# Altium project retic.PrjPCB
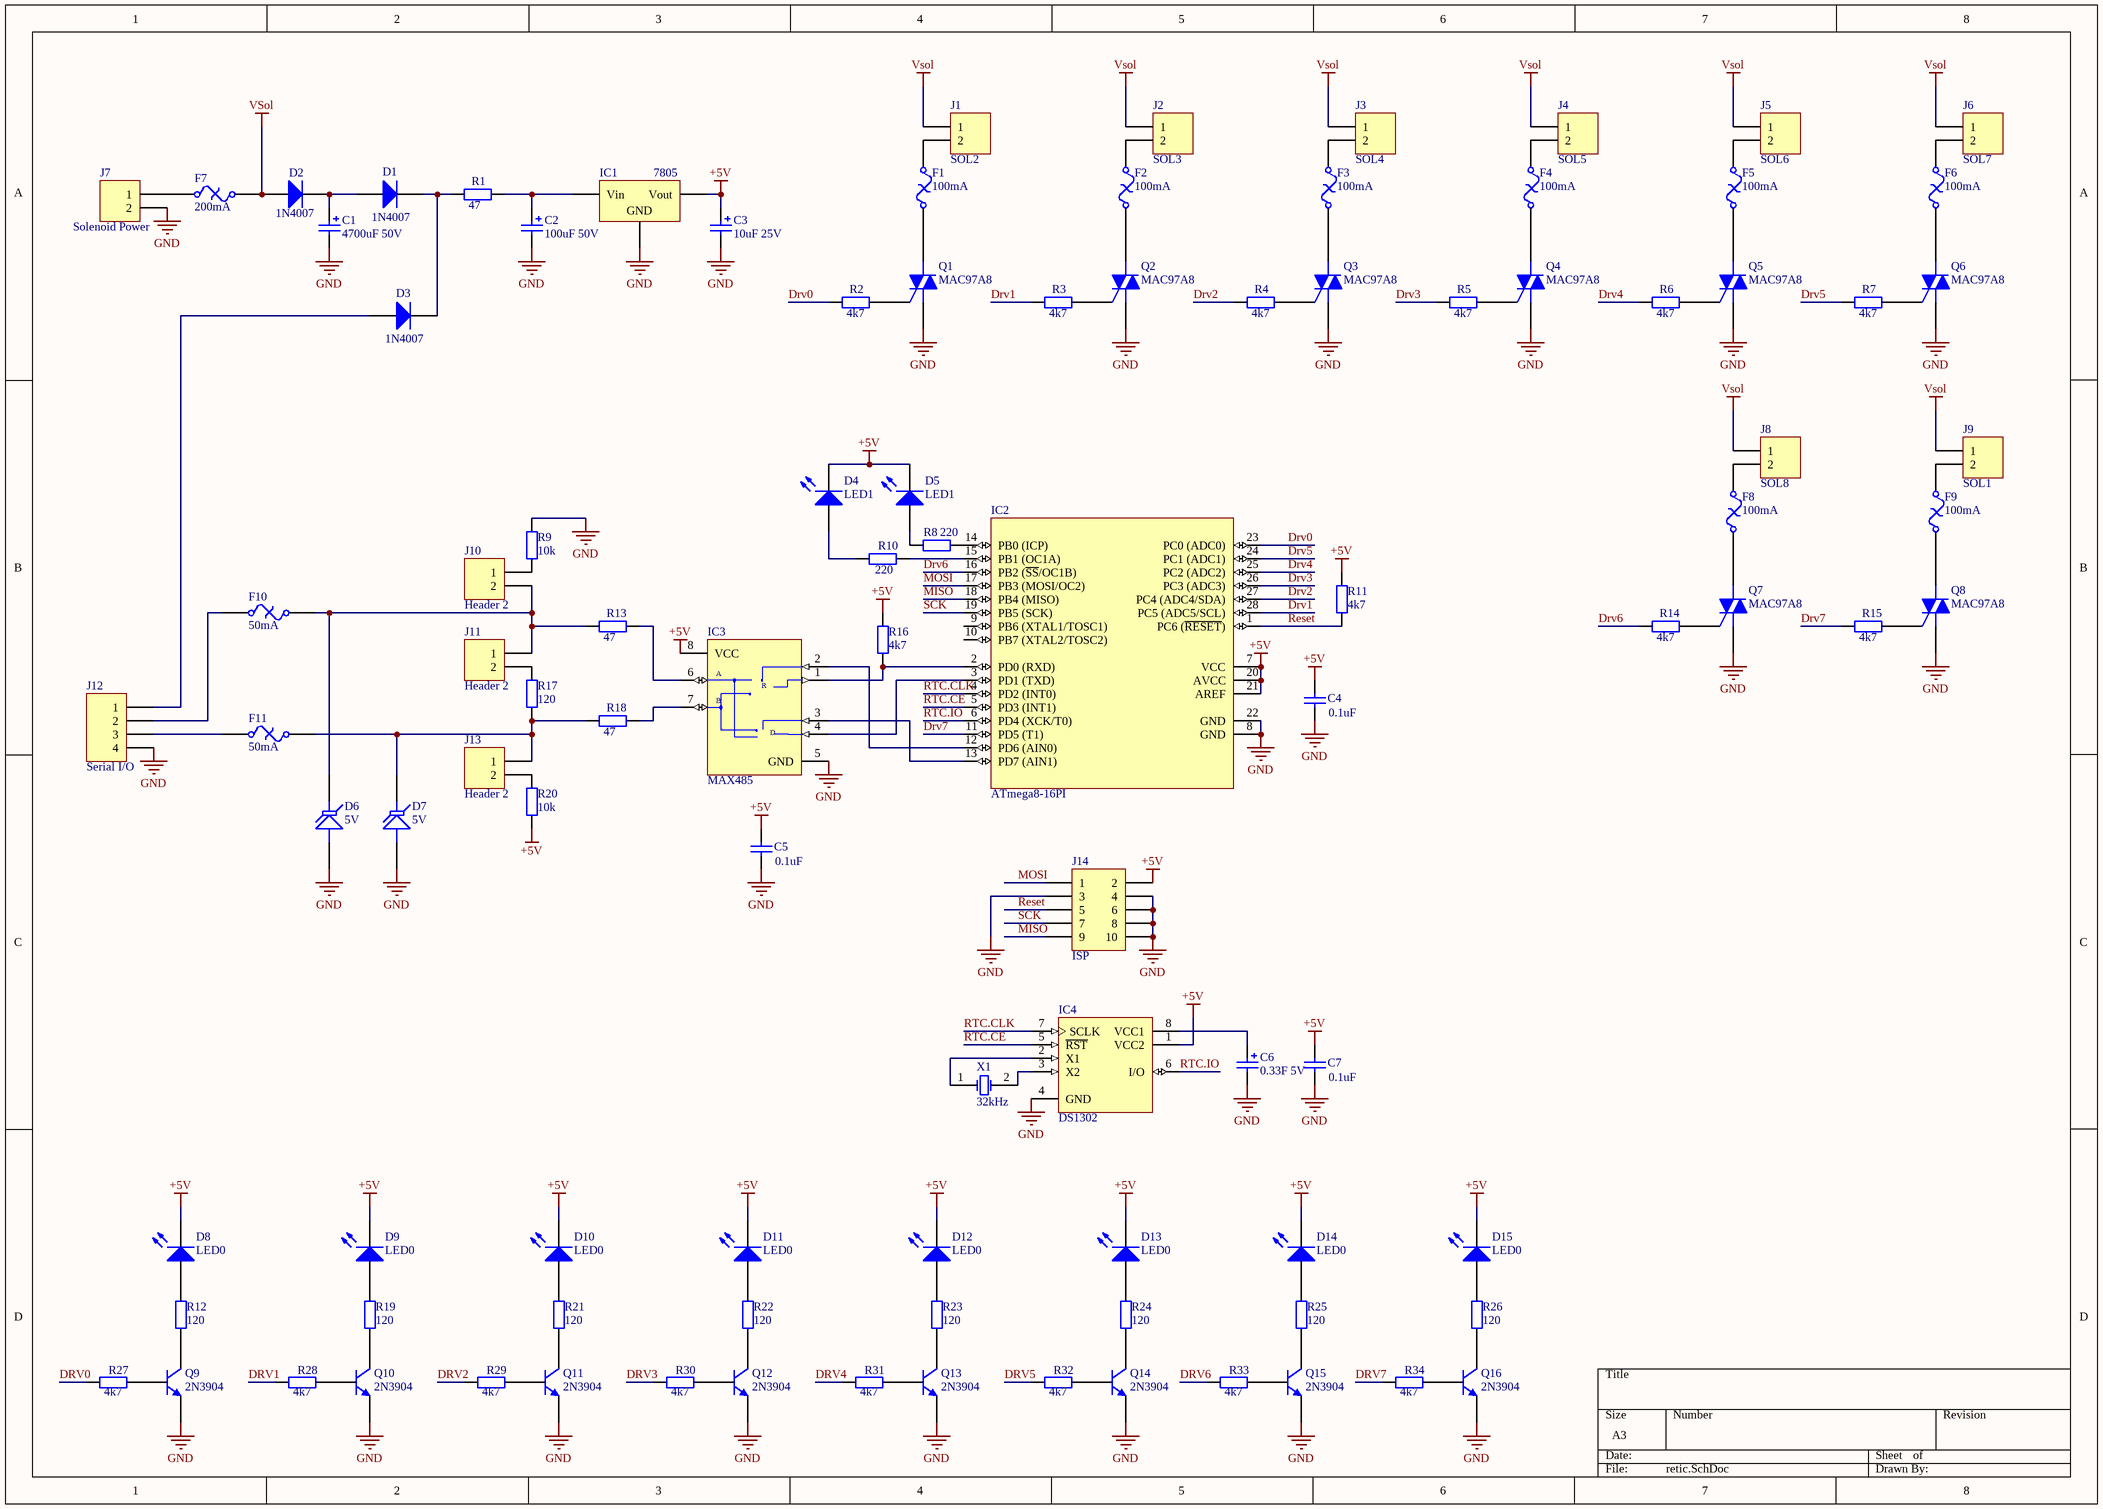
[diagram p0: retic.SchDoc]
1 sheet, 102 parts. Net scope: global (net labels, ports and power ports of the same name join across sheets).
Board file: retic.PcbDoc

## Sheet retic.SchDoc
size A3

### Parts
C1  4700uF 50V  [CAPPR7.5-16x35]
C2  100uF 50V  [CAPPR5-5x5]
C3  10uF 25V  [CAPPR2-5x6.8]
C4  0.1uF  [RAD-0.3]
C5  0.1uF  [RAD-0.3]
C6  0.33F 5V  [POLAR0.8]
C7  0.1uF  [RAD-0.3]
D1  1N4007  [DIO10.46-5.3x2.8]
D2  1N4007  [DIO10.46-5.3x2.8]
D3  1N4007  [DIO10.46-5.3x2.8]
D4  LED1  [LED-1]
D5  LED1  [LED-1]
D6  5V  [DIO10.2-7x2.7]
D7  5V  [DIO10.2-7x2.7]
D8  LED0  [LED-0]
D9  LED0  [LED-0]
D10  LED0  [LED-0]
D11  LED0  [LED-0]
D12  LED0  [LED-0]
D13  LED0  [LED-0]
D14  LED0  [LED-0]
D15  LED0  [LED-0]
F1  100mA  [PIN-W2/E2.8]
F2  100mA  [PIN-W2/E2.8]
F3  100mA  [PIN-W2/E2.8]
F4  100mA  [PIN-W2/E2.8]
F5  100mA  [PIN-W2/E2.8]
F6  100mA  [PIN-W2/E2.8]
F7  200mA  [PIN-W2/E2.8]
F8  100mA  [PIN-W2/E2.8]
F9  100mA  [PIN-W2/E2.8]
F10  50mA  [PIN-W2/E2.8]
F11  50mA  [PIN-W2/E2.8]
IC1  7805  [TO220]
IC2  ATmega8-16PI  [28P3]
IC3  MAX485  [PA8]
IC4  DS1302  [DIP8]
J1  SOL2  [Screw2]
J2  SOL3  [Screw2]
J3  SOL4  [Screw2]
J4  SOL5  [Screw2]
J5  SOL6  [Screw2]
J6  SOL7  [Screw2]
J7  Solenoid Power  [HDR1X2]
J8  SOL8  [Screw2]
J9  SOL1  [Screw2]
J10  Header 2  [HDR1X2]
J11  Header 2  [HDR1X2]
J12  Serial I/O  [HDR1X4]
J13  Header 2  [HDR1X2]
J14  ISP  [HDR2X5]
Q1  MAC97A8  [T092]
Q2  MAC97A8  [T092]
Q3  MAC97A8  [T092]
Q4  MAC97A8  [T092]
Q5  MAC97A8  [T092]
Q6  MAC97A8  [T092]
Q7  MAC97A8  [T092]
Q8  MAC97A8  [T092]
Q9  2N3904  [T092]
Q10  2N3904  [T092]
Q11  2N3904  [T092]
Q12  2N3904  [T092]
Q13  2N3904  [T092]
Q14  2N3904  [T092]
Q15  2N3904  [T092]
Q16  2N3904  [T092]
R1  47  [AXIAL-0.3]
R2  4k7  [AXIAL-0.3]
R3  4k7  [AXIAL-0.3]
R4  4k7  [AXIAL-0.3]
R5  4k7  [AXIAL-0.3]
R6  4k7  [AXIAL-0.3]
R7  4k7  [AXIAL-0.3]
R8  220  [AXIAL-0.3]
R9  10k  [AXIAL-0.3]
R10  220  [AXIAL-0.3]
R11  4k7  [AXIAL-0.3]
R12  120  [AXIAL-0.3]
R13  47  [AXIAL-0.3]
R14  4k7  [AXIAL-0.3]
R15  4k7  [AXIAL-0.3]
R16  4k7  [AXIAL-0.3]
R17  120  [AXIAL-0.3]
R18  47  [AXIAL-0.3]
R19  120  [AXIAL-0.3]
R20  10k  [AXIAL-0.3]
R21  120  [AXIAL-0.3]
R22  120  [AXIAL-0.3]
R23  120  [AXIAL-0.3]
R24  120  [AXIAL-0.3]
R25  120  [AXIAL-0.3]
R26  120  [AXIAL-0.3]
R27  4k7  [AXIAL-0.3]
R28  4k7  [AXIAL-0.3]
R29  4k7  [AXIAL-0.3]
R30  4k7  [AXIAL-0.3]
R31  4k7  [AXIAL-0.3]
R32  4k7  [AXIAL-0.3]
R33  4k7  [AXIAL-0.3]
R34  4k7  [AXIAL-0.3]
X1  32kHz  [BCY-W2/D3.1]

### Nets
+5V: C3.1 C4.2 C5.2 C7.2 D4.2(K) D5.2(K) D8.2(K) D9.2(K) D10.2(K) D11.2(K) D12.2(K) D13.2(K) D14.2(K) D15.2(K) IC1.3(Vout) IC2.7(VCC) IC2.20(AVCC) IC2.21(AREF) IC3.8(VCC) IC4.1(VCC2) J14.2 R11.2 R16.2 R20.1
GND: C1.2 C2.2 C3.2 C4.1 C5.1 C6.2 C7.1 D6.1(A) D7.1(A) IC1.2(GND) IC2.8(GND) IC2.22(GND) IC3.5(GND) IC4.4(GND) J7.2 J12.4 J14.3 J14.4 J14.6 J14.8 J14.10 Q1.3(M1) Q2.3(M1) Q3.3(M1) Q4.3(M1) Q5.3(M1) Q6.3(M1) Q7.3(M1) Q8.3(M1) Q9.1(E) Q10.1(E) Q11.1(E) Q12.1(E) Q13.1(E) Q14.1(E) Q15.1(E) Q16.1(E) R9.2
Vsol: D2.1(A) F7.1 J1.1 J2.1 J3.1 J4.1 J5.1 J6.1 J8.1 J9.1
Drv0: IC2.23(PC0_(ADC0)) R2.1 R27.1
Drv1: IC2.28(PC5_(ADC5/SCL)) R3.1 R28.1
Drv2: IC2.27(PC4_(ADC4/SDA)) R4.1 R29.1
Drv3: IC2.26(PC3_(ADC3)) R5.1 R30.1
Drv4: IC2.25(PC2_(ADC2)) R6.1 R31.1
Drv5: IC2.24(PC1_(ADC1)) R7.1 R32.1
Drv6: IC2.16(PB2_(~{SS}/OC1B)) R14.1 R33.1
Drv7: IC2.11(PD5_(T1)) R15.1 R34.1
MISO: IC2.18(PB4_(MISO)) J14.9
MOSI: IC2.17(PB3_(MOSI/OC2)) J14.1
Reset: IC2.1(PC6_(~{RESET})) J14.5 R11.1
RTC.CE: IC2.5(PD3_(INT1)) IC4.5(~{RST})
RTC.CLK: IC2.4(PD2_(INT0)) IC4.7(SCLK)
RTC.IO: IC2.6(PD4_(XCK/T0)) IC4.6(I/O)
SCK: IC2.19(PB5_(SCK)) J14.7
NetC1_1: C1.1 D1.1(A) D2.2(K)
NetC2_1: C2.1 IC1.1(Vin) R1.2
NetC6_1: C6.1 IC4.8(VCC1)
NetD1_2: D1.2(K) D3.2(K) R1.1
NetD3_1: D3.1(A) J12.1
NetD4_1: D4.1(A) R10.2
NetD5_1: D5.1(A) R8.2
NetD6_2: D6.2(K) F10.1 J10.2 J11.1 R13.1
NetD7_2: D7.2(K) F11.1 J13.1 R17.1 R18.1
NetD8_1: D8.1(A) R12.2
NetD9_1: D9.1(A) R19.2
NetD10_1: D10.1(A) R21.2
NetD11_1: D11.1(A) R22.2
NetD12_1: D12.1(A) R23.2
NetD13_1: D13.1(A) R24.2
NetD14_1: D14.1(A) R25.2
NetD15_1: D15.1(A) R26.2
NetF1_1: F1.1 Q1.1(M2)
NetF1_2: F1.2 J1.2
NetF2_1: F2.1 Q2.1(M2)
NetF2_2: F2.2 J2.2
NetF3_1: F3.1 Q3.1(M2)
NetF3_2: F3.2 J3.2
NetF4_1: F4.1 Q4.1(M2)
NetF4_2: F4.2 J4.2
NetF5_1: F5.1 Q5.1(M2)
NetF5_2: F5.2 J5.2
NetF6_1: F6.1 Q6.1(M2)
NetF6_2: F6.2 J6.2
NetF7_2: F7.2 J7.1
NetF8_1: F8.1 Q7.1(M2)
NetF8_2: F8.2 J8.2
NetF9_1: F9.1 Q8.1(M2)
NetF9_2: F9.2 J9.2
NetF10_2: F10.2 J12.2
NetF11_2: F11.2 J12.3
NetIC2_2: IC2.2(PD0_(RXD)) IC3.1(RO) R16.1
NetIC2_3: IC2.3(PD1_(TXD)) IC3.4(DI)
NetIC2_12: IC2.12(PD6_(AIN0)) IC3.2(~{RE})
NetIC2_13: IC2.13(PD7_(AIN1)) IC3.3(DE)
NetIC2_14: IC2.14(PB0_(ICP)) R8.1
NetIC2_15: IC2.15(PB1_(OC1A)) R10.1
NetIC3_6: IC3.6(A) R13.2
NetIC3_7: IC3.7(B) R18.2
NetIC4_2: IC4.2(X1) X1.1(OSC1)
NetIC4_3: IC4.3(X2) X1.2(OSC2)
NetJ10_1: J10.1 R9.1
NetJ11_2: J11.2 R17.2
NetJ13_2: J13.2 R20.2
NetQ1_2: Q1.2(G) R2.2
NetQ2_2: Q2.2(G) R3.2
NetQ3_2: Q3.2(G) R4.2
NetQ4_2: Q4.2(G) R5.2
NetQ5_2: Q5.2(G) R6.2
NetQ6_2: Q6.2(G) R7.2
NetQ7_2: Q7.2(G) R14.2
NetQ8_2: Q8.2(G) R15.2
NetQ9_2: Q9.2(B) R27.2
NetQ9_3: Q9.3(C) R12.1
NetQ10_2: Q10.2(B) R28.2
NetQ10_3: Q10.3(C) R19.1
NetQ11_2: Q11.2(B) R29.2
NetQ11_3: Q11.3(C) R21.1
NetQ12_2: Q12.2(B) R30.2
NetQ12_3: Q12.3(C) R22.1
NetQ13_2: Q13.2(B) R31.2
NetQ13_3: Q13.3(C) R23.1
NetQ14_2: Q14.2(B) R32.2
NetQ14_3: Q14.3(C) R24.1
NetQ15_2: Q15.2(B) R33.2
NetQ15_3: Q15.3(C) R25.1
NetQ16_2: Q16.2(B) R34.2
NetQ16_3: Q16.3(C) R26.1

Not connected (* = marked no-connect by the designer): IC2 9(PB6_(XTAL1/TOSC1)) 10(PB7_(XTAL2/TOSC2))

### Notes on the sheet
- (in symbol MAX485EPA) R; D

### Library data of the parts
C1-C3 C6 = Cap Pol2: Polarized Capacitor (Axial); Published: 8-Jun-2000; LatestRevisionDate: 17-Jul-2002; LatestRevisionNote: Re-released for DXP Platform.; PackageReference: POLAR0.8; Publisher: Altium Limited
  C1: Value: 4700uF 50V
  C2: Value: 100uF 50V
  C3: Value: 10uF 25V
  C6: Value: 0.33F 5V
C4 C5 C7 = Cap: Capacitor; Published: 8-Jun-2000; LatestRevisionDate: 17-Jul-2002; LatestRevisionNote: Re-released for DXP Platform.; PackageReference: RAD-0.3; Publisher: Altium Limited; Value: 0.1uF
D1-D3 = Diode 1N4007: 1 Amp General Purpose Rectifier; Published: 8-Jun-2000; LatestRevisionDate: 17-Jul-2002; LatestRevisionNote: Re-released for DXP Platform.; DatasheetVersion: 1998; PackageVersion: Aug-1999; PackageReference: DO-41; Publisher: Altium Limited; Code_JEDEC: DO-204-AL; ComponentLink1Description: Manufacturer Link; ComponentLink1URL: http://www.fairchildsemi.com/; ComponentLink2Description: Datasheet; ComponentLink2URL: http://www.fairchildsemi.com/ds/1N%2F1N4001.pdf
D4 D5 = LED1: Typical RED GaAs LED; Published: 8-Jun-2000; LatestRevisionDate: 08-Jul-2005; LatestRevisionNote: Mech Layer 1 removed.; PackageReference: LED-1; Publisher: Altium Limited
D6 D7 = Tranzorb: Published: 24-Mar-1999; LatestRevisionDate: 17-Jul-2002; LatestRevisionNote: Re-released for DXP Platform.; PackageReference: DO-7; Publisher: Altium Limited
D8-D15 = LED0: Typical INFRARED GaAs LED; Published: 8-Jun-2000; LatestRevisionDate: 08-Jul-2005; LatestRevisionNote: Mech Layer 1 removed.; PackageReference: LED-0; Publisher: Altium Limited
F1-F11 = Fuse Thermal: Thermal Fuse; Published: 24-Mar-1999; LatestRevisionDate: 17-Jul-2002; LatestRevisionNote: Re-released for DXP Platform.; PackageReference: PIN-W2/E2.8; Publisher: Altium Limited
IC1 = Volt Reg: Voltage Regulator; Published: 24-Mar-1999; LatestRevisionDate: 29-May-2009; LatestRevisionNote: IPC-7351 Footprint Added.; PackageReference: D2PAK; Publisher: Altium Limited; PackageDescription: 3-Pin Transistor Outline Package 2.54 mm Pitch, 15.1 mm Lead Span
IC2 = ATmega8-16PI: 8-Bit AVR Microcontroller with 8K Bytes of In-System Programmable Flash Memory; Published: 17-Sep-2003; LatestRevisionDate: 04-Mar-2005; LatestRevisionNote: Stylized 3D Model Added.; DatasheetVersion: 2486H-AVR-09/02; PackageVersion: revB, Sep-2001; PackageReference: 28P3; Publisher: Altium Limited; PackageDescription: DIP; 28 Leads; Row Spacing 7.62 mm; Pitch 2.54 mm; ComponentLink1Description: Manufacturer Link; ComponentLink1URL: http://www.atmel.com; ComponentLink2Description: Datasheet; ComponentLink2URL: http://www.atmel.com/dyn/resources/prod_documents/doc2486.pdf
IC3 = MAX485EPA: Low-Power, Slew-Rate-Limited RS-485/RS-422 Transceiver; Published: 16-Jan-2001; LatestRevisionDate: 29-May-2009; LatestRevisionNote: Component Body Added.; DatasheetVersion: Feb-1996; PackageVersion: RevB, 21-0043; PackageReference: PA8; Publisher: Altium Limited; PackageDescription: DIP, 8-Pin, Row Spacing 7.62 mm, Pitch 2.54 mm; Code_JEDEC: MS-001-AB; ComponentLink1Description: Manufacturer Link; ComponentLink1URL: http://www.maxim-ic.com/; ComponentLink2Description: Datasheet; ComponentLink2URL: http://pdfserv.maxim-ic.com/en/ds/MAX1487-MAX491.pdf
IC4 = DS1302: Trickle Charge Timekeeping Chip; Published: 13-Oct-2000; LatestRevisionDate: 06-Jun-2005; LatestRevisionNote: Stylized 3D Model Added.; DatasheetVersion: 2-Jul-1999; PackageVersion: 1999; PackageReference: DIP8; Publisher: Altium Limited; PackageDescription: DIP; 8 Leads; Row Spacing 7.62 mm; Pitch 2.54 mm; ComponentLink1Description: Manufacturer Link; ComponentLink1URL: http://www.maxim-ic.com/; ComponentLink2Description: Datasheet; ComponentLink2URL: http://pdfserv.maxim-ic.com/en/ds/DS1302.pdf
J1-J11 J13 = Header 2: Header, 2-Pin; LatestRevisionDate: 17-Jul-2002; LatestRevisionNote: Re-released for DXP Platform.; Publisher: Altium Limited
J12 = Header 4: Header, 4-Pin; LatestRevisionDate: 17-Jul-2002; LatestRevisionNote: Re-released for DXP Platform.; Publisher: Altium Limited
J14 = Header 5X2: Header, 5-Pin, Dual row; LatestRevisionDate: 17-Jul-2002; LatestRevisionNote: Re-released for DXP Platform.; Publisher: Altium Limited
Q1-Q8 = Triac: Silicon Bidirectional Triode Thyristor; Note: Pin 2 is electrically connected to Pin 4 (TAB); Published: 29-Sep-2000; LatestRevisionDate: 17-Jul-2002; LatestRevisionNote: Re-released for DXP Platform.; DatasheetVersion: 1999; PackageReference: 369-03; Publisher: Altium Limited; Code_JEDEC: TO-251-AA; ComponentLink1Description: Manufacturer Link; ComponentLink1URL: http://www.motorola.com/
Q9-Q16 = 2N3904: NPN General Purpose Amplifier; Published: 8-Jun-2000; LatestRevisionDate: 15-Jan-2003; LatestRevisionNote: PCB Footprint 'BCY-W3/D4.7' replaced; DatasheetVersion: 1997; PackageVersion: Sep-1998; PackageReference: TO-92A; Publisher: Altium Limited; Code_JEDEC: TO-92A; ComponentLink1Description: Manufacturer Link; ComponentLink1URL: http://www.fairchildsemi.com/; ComponentLink2Description: Datasheet; ComponentLink2URL: http://www.fairchildsemi.com/ds/2N%2F2N3904.pdf
R1-R34 = Res2: Resistor; Published: 8-Jun-2000; LatestRevisionDate: 17-Jul-2002; LatestRevisionNote: Re-released for DXP Platform.; PackageReference: AXIAL-0.4; Publisher: Altium Limited
  R1 R13 R18: Value: 47
  R2-R7 R11 R14-R16 R27-R34: Value: 4k7
  R8 R10: Value: 220
  R9 R20: Value: 10k
  R12 R17 R19 R21-R26: Value: 120
X1 = XTAL: Crystal Oscillator; Published: 8-Jun-2000; LatestRevisionDate: 17-Jul-2002; LatestRevisionNote: Re-released for DXP Platform.; PackageReference: R38; Publisher: Altium Limited